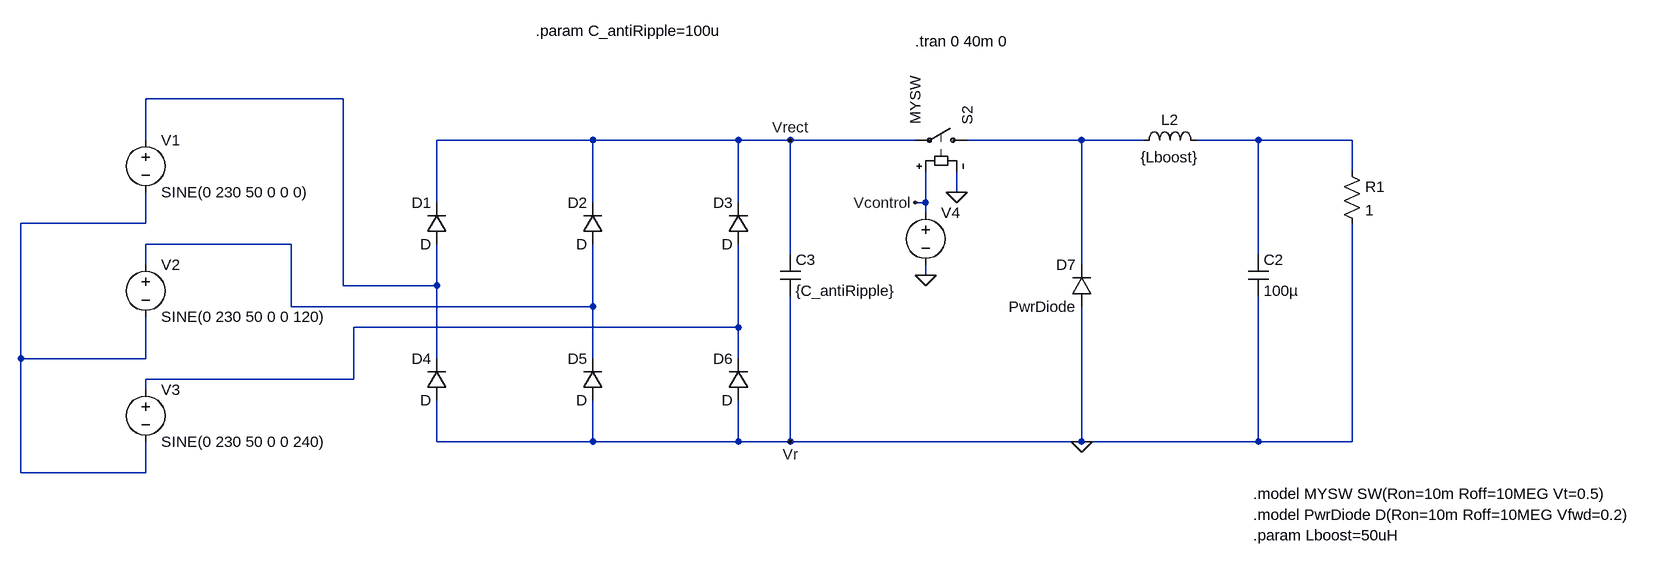
[diagram p0: schematic FullWaveRectfier_BuckConverter_circuit.asc]
FullWaveRectfier_BuckConverter_circuit.asc, the LTspice schematic file:
Version 4
SHEET 1 2520 680
WIRE -160 -80 -464 -80
WIRE -464 -16 -464 -80
WIRE 224 -16 -16 -16
WIRE 448 -16 224 -16
WIRE 528 -16 448 -16
WIRE 720 -16 528 -16
WIRE 976 -16 800 -16
WIRE 1072 -16 976 -16
WIRE 1248 -16 1152 -16
WIRE 1392 -16 1248 -16
WIRE 1392 32 1392 -16
WIRE 784 64 784 32
WIRE -16 80 -16 -16
WIRE 224 80 224 -16
WIRE 448 80 448 -16
WIRE 736 80 736 32
WIRE 736 80 720 80
WIRE 736 96 736 80
WIRE -464 112 -464 64
WIRE -464 112 -656 112
WIRE -240 144 -464 144
WIRE 528 160 528 -16
WIRE 1248 160 1248 -16
WIRE -464 176 -464 144
WIRE 976 176 976 -16
WIRE 736 192 736 176
WIRE -160 208 -160 -80
WIRE -16 208 -16 144
WIRE -16 208 -160 208
WIRE -240 240 -240 144
WIRE 224 240 224 144
WIRE 224 240 -240 240
WIRE 448 272 448 144
WIRE 448 272 -144 272
WIRE -656 320 -656 112
WIRE -464 320 -464 256
WIRE -464 320 -656 320
WIRE -16 320 -16 208
WIRE 224 320 224 240
WIRE 448 320 448 272
WIRE -144 352 -144 272
WIRE -144 352 -464 352
WIRE -464 368 -464 352
WIRE -16 448 -16 384
WIRE 224 448 224 384
WIRE 224 448 -16 448
WIRE 448 448 448 384
WIRE 448 448 224 448
WIRE 528 448 528 224
WIRE 528 448 448 448
WIRE 976 448 976 240
WIRE 976 448 528 448
WIRE 1248 448 1248 224
WIRE 1248 448 976 448
WIRE 1392 448 1392 112
WIRE 1392 448 1248 448
WIRE -656 496 -656 320
WIRE -464 496 -464 448
WIRE -464 496 -656 496
FLAG 976 448 0
FLAG 528 -16 Vrect
FLAG 528 448 Vr
FLAG 784 64 0
FLAG 736 192 0
FLAG 720 80 Vcontrol
SYMBOL diode 0 144 R180
WINDOW 0 24 64 Left 2
WINDOW 3 24 0 Left 2
SYMATTR InstName D1
SYMBOL diode 240 144 R180
WINDOW 0 24 64 Left 2
WINDOW 3 24 0 Left 2
SYMATTR InstName D2
SYMBOL diode 464 144 R180
WINDOW 0 24 64 Left 2
WINDOW 3 24 0 Left 2
SYMATTR InstName D3
SYMBOL diode 0 384 R180
WINDOW 0 24 64 Left 2
WINDOW 3 24 0 Left 2
SYMATTR InstName D4
SYMBOL diode 240 384 R180
WINDOW 0 24 64 Left 2
WINDOW 3 24 0 Left 2
SYMATTR InstName D5
SYMBOL diode 464 384 R180
WINDOW 0 24 64 Left 2
WINDOW 3 24 0 Left 2
SYMATTR InstName D6
SYMBOL voltage -464 -32 R0
WINDOW 123 0 0 Left 0
WINDOW 39 0 0 Left 0
SYMATTR InstName V1
SYMATTR Value SINE(0 230 50 0 0 0)
SYMBOL voltage -464 160 R0
WINDOW 123 0 0 Left 0
WINDOW 39 0 0 Left 0
SYMATTR InstName V2
SYMATTR Value SINE(0 230 50 0 0 120)
SYMBOL voltage -464 352 R0
WINDOW 123 0 0 Left 0
WINDOW 39 0 0 Left 0
SYMATTR InstName V3
SYMATTR Value SINE(0 230 50 0 0 240)
SYMBOL cap 512 160 R0
SYMATTR InstName C3
SYMATTR Value {C_antiRipple}
SYMBOL sw 816 -16 M270
SYMATTR InstName S2
SYMATTR Value MYSW
SYMBOL voltage 736 80 R0
WINDOW 3 15 111 Invisible 2
WINDOW 123 0 0 Left 0
WINDOW 39 0 0 Left 0
SYMATTR Value PULSE(0 1 0 1n 1n {0.054*50u} 50u)
SYMATTR InstName V4
SYMBOL ind 1056 0 R270
WINDOW 0 32 56 VTop 2
WINDOW 3 5 56 VBottom 2
SYMATTR InstName L2
SYMATTR Value {Lboost}
SYMBOL diode 992 240 R180
WINDOW 0 24 64 Left 2
WINDOW 3 24 0 Left 2
SYMATTR InstName D7
SYMATTR Value PwrDiode
SYMBOL cap 1232 160 R0
SYMATTR InstName C2
SYMATTR Value 100µ
SYMBOL res 1376 16 R0
SYMATTR InstName R1
SYMATTR Value 1
TEXT 720 -168 Left 2 !.tran 0 40m 0
TEXT 136 -184 Left 2 !.param C_antiRipple=100u
TEXT 1240 528 Left 2 !.model MYSW SW(Ron=10m Roff=10MEG Vt=0.5)
TEXT 1240 592 Left 2 !.param Lboost=50uH
TEXT 1240 560 Left 2 !.model PwrDiode D(Ron=10m Roff=10MEG Vfwd=0.2)

The netlist it stands for:
* FullWaveRectfier_BuckConverter_circuit.asc
D1 N001 Vrect D
D2 N005 Vrect D
D3 N006 Vrect D
D4 0 N001 D
D5 0 N005 D
D6 0 N006 D
V1 N001 N004 SINE(0 230 50 0 0 0)
V2 N005 N004 SINE(0 230 50 0 0 120)
V3 N006 N004 SINE(0 230 50 0 0 240)
C3 Vrect 0 {C_antiRipple}
S2 N002 Vrect Vcontrol 0 MYSW
V4 Vcontrol 0 PULSE(0 1 0 1n 1n {0.054*50u} 50u)
L2 N002 N003 {Lboost}
D7 0 N002 PwrDiode
C2 N003 0 100µ
R1 N003 0 1
.model D D
.lib standard.dio
.tran 0 40m 0
.param C_antiRipple=100u
.model MYSW SW(Ron=10m Roff=10MEG Vt=0.5)
.param Lboost=50uH
.model PwrDiode D(Ron=10m Roff=10MEG Vfwd=0.2)
.backanno
.end